# EAGLE design pt2MX (EAGLE 6.4)
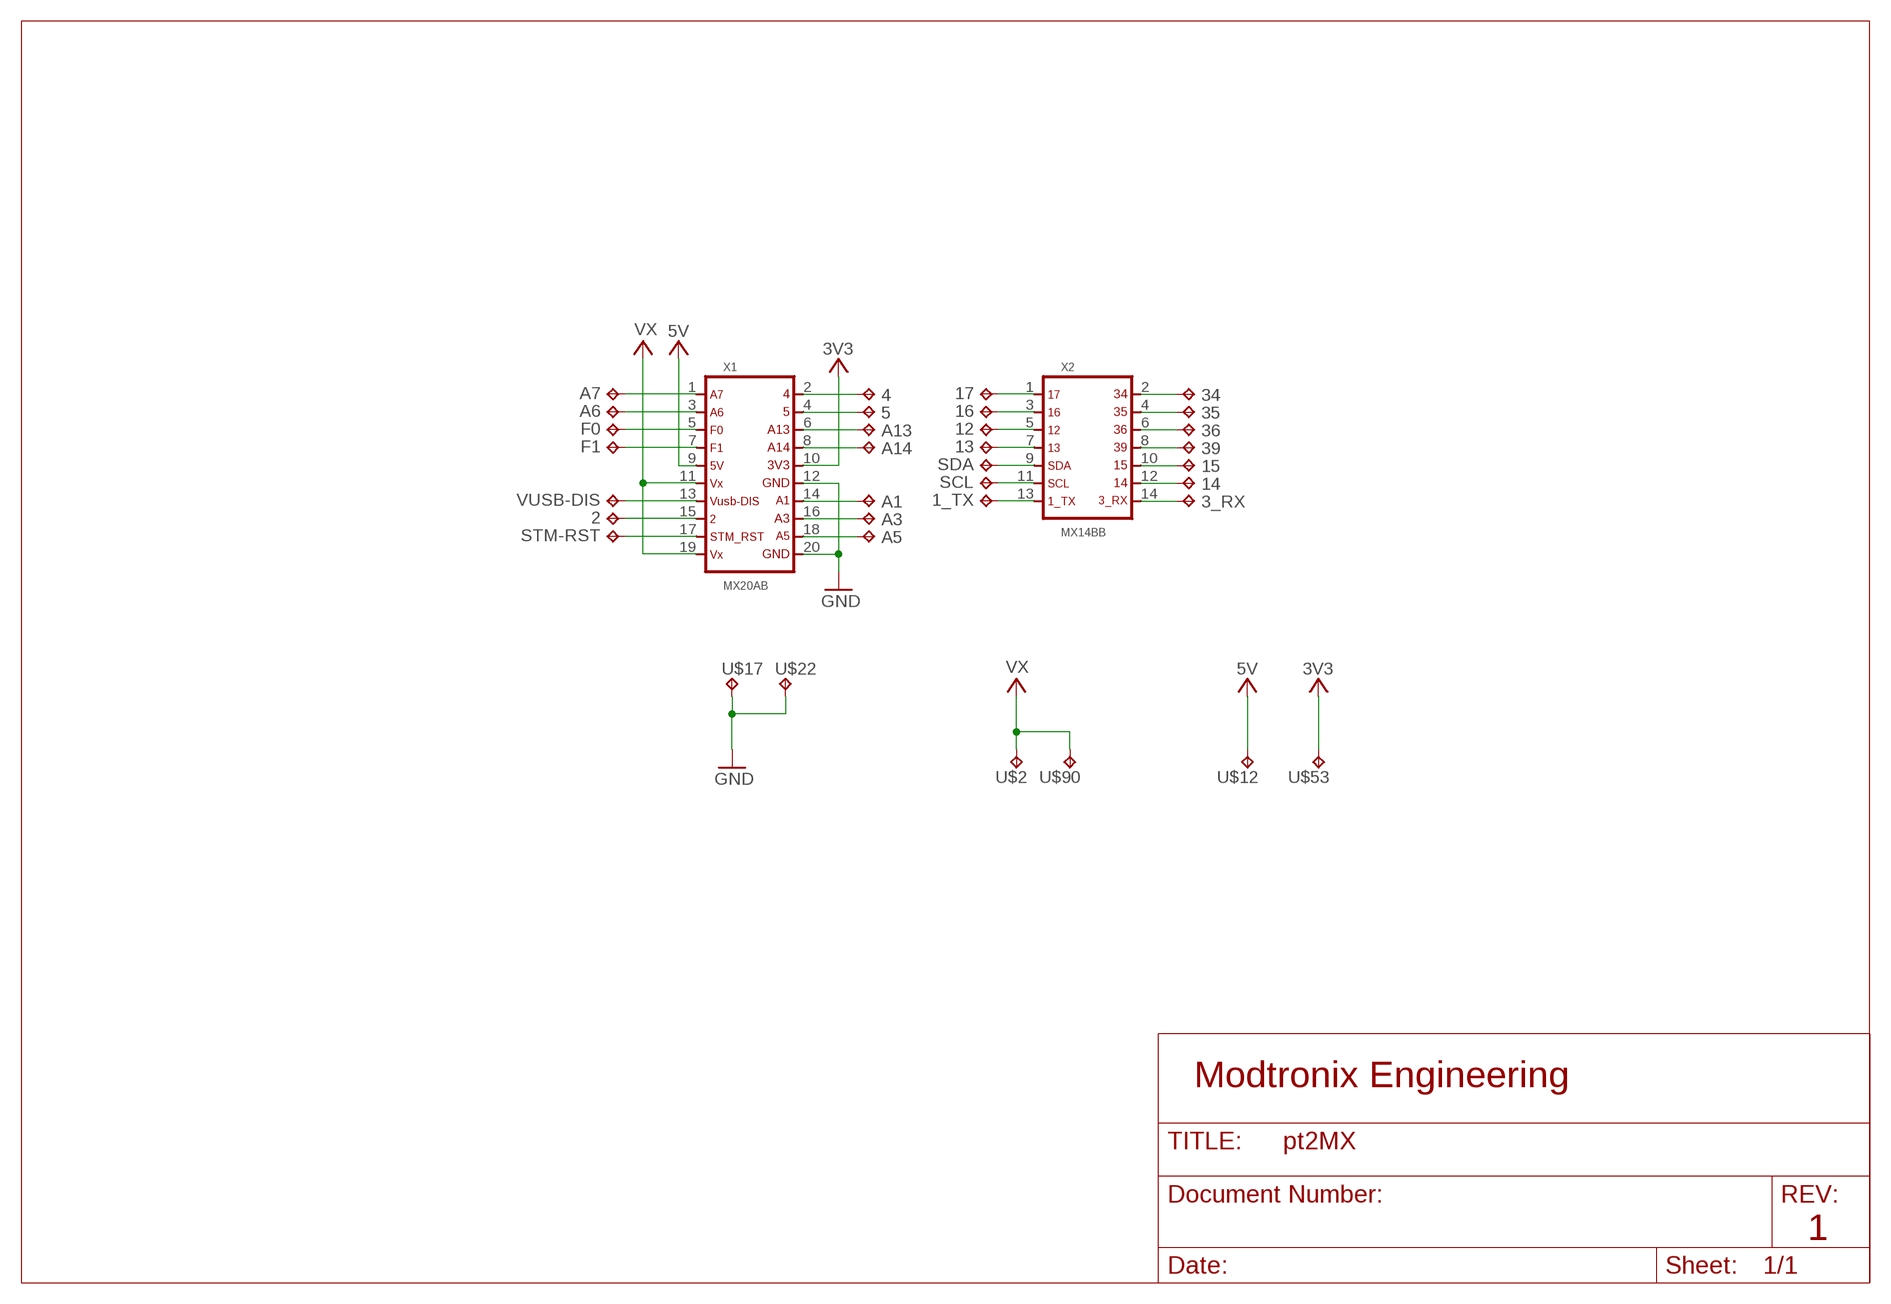
[diagram p0: schematic, sheet 1]

## Parts
1_TX  TPD10-D200  [TP-10-D200]
2  TPD10-D200  [TP-10-D200]
3_RX  TPD10-D200  [TP-10-D200]
4  TPD10-D200  [TP-10-D200]
5  TPD10-D200  [TP-10-D200]
12  TPD10-D200  [TP-10-D200]
13  TPD10-D200  [TP-10-D200]
14  TPD10-D200  [TP-10-D200]
15  TPD10-D200  [TP-10-D200]
16  TPD10-D200  [TP-10-D200]
17  TPD10-D200  [TP-10-D200]
34  TPD10-D200  [TP-10-D200]
35  TPD10-D200  [TP-10-D200]
36  TPD10-D200  [TP-10-D200]
39  TPD10-D200  [TP-10-D200]
A1  TPD10-D200  [TP-10-D200]
A3  TPD10-D200  [TP-10-D200]
A5  TPD10-D200  [TP-10-D200]
A6  TPD10-D200  [TP-10-D200]
A7  TPD10-D200  [TP-10-D200]
A13  TPD10-D200  [TP-10-D200]
A14  TPD10-D200  [TP-10-D200]
F0  TPD10-D200  [TP-10-D200]
F1  TPD10-D200  [TP-10-D200]
SCL  TPD10-D200  [TP-10-D200]
SDA  TPD10-D200  [TP-10-D200]
STM-RST  TPD10-D200  [TP-10-D200]
U$2  TPD10-D200  [TP-10-D200]
U$12  TPD10-D200  [TP-10-D200]
U$17  TPD10-D200  [TP-10-D200]
U$22  TPD10-D200  [TP-10-D200]
U$53  TPD10-D200  [TP-10-D200]
U$90  TPD10-D200  [TP-10-D200]
VUSB-DIS  TPD10-D200  [TP-10-D200]
X1  MX20AB  [MA10-2-NONUM]
X2  MX14BB  [MA07-2-NONUM]

## Nets
1_TX: 1_TX.1(TP) X2.13
2: 2.1(TP) X1.15
3_RX: 3_RX.1(TP) X2.14
3V3: U$53.1(TP) X1.10
4: 4.1(TP) X1.2
5: 5.1(TP) X1.4
5V [power]: U$12.1(TP) X1.9
12: 12.1(TP) X2.5
13: 13.1(TP) X2.7
14: 14.1(TP) X2.12
15: 15.1(TP) X2.10
16: 16.1(TP) X2.3
17: 17.1(TP) X2.1
34: 34.1(TP) X2.2
35: 35.1(TP) X2.4
36: 36.1(TP) X2.6
39: 39.1(TP) X2.8
A1: A1.1(TP) X1.14
A3: A3.1(TP) X1.16
A5: A5.1(TP) X1.18
A6: A6.1(TP) X1.3
A7: A7.1(TP) X1.1
A13: A13.1(TP) X1.6
A14: A14.1(TP) X1.8
F0: F0.1(TP) X1.5
F1: F1.1(TP) X1.7
GND [power]: U$17.1(TP) U$22.1(TP) X1.12 X1.20
SCL: SCL.1(TP) X2.11
SDA: SDA.1(TP) X2.9
STM-RST: STM-RST.1(TP) X1.17
VUSB-DIS: VUSB-DIS.1(TP) X1.13
VX [power]: U$2.1(TP) U$90.1(TP) X1.11 X1.19

## Notes on the sheet
- Modtronix Engineering
- 1

## Library data of the parts
1_TX 2 3_RX 4 5 12-17 34-36 39 A1 A3 A5-A7 A13 A14 F0 F1 SCL SDA STM-RST U$2 U$12 U$17 U$22 U$53 U$90 VUSB-DIS = mx-conn:TP
X1 = mx-conn:MX20A
X2 = mx-conn:MX14B

## Net classes
0 default: width 0.2 mm, drill 0.5 mm, clearance 0.2 mm
1 power: width 0.3 mm, drill 0.5 mm, clearance 0.2 mm

## Board
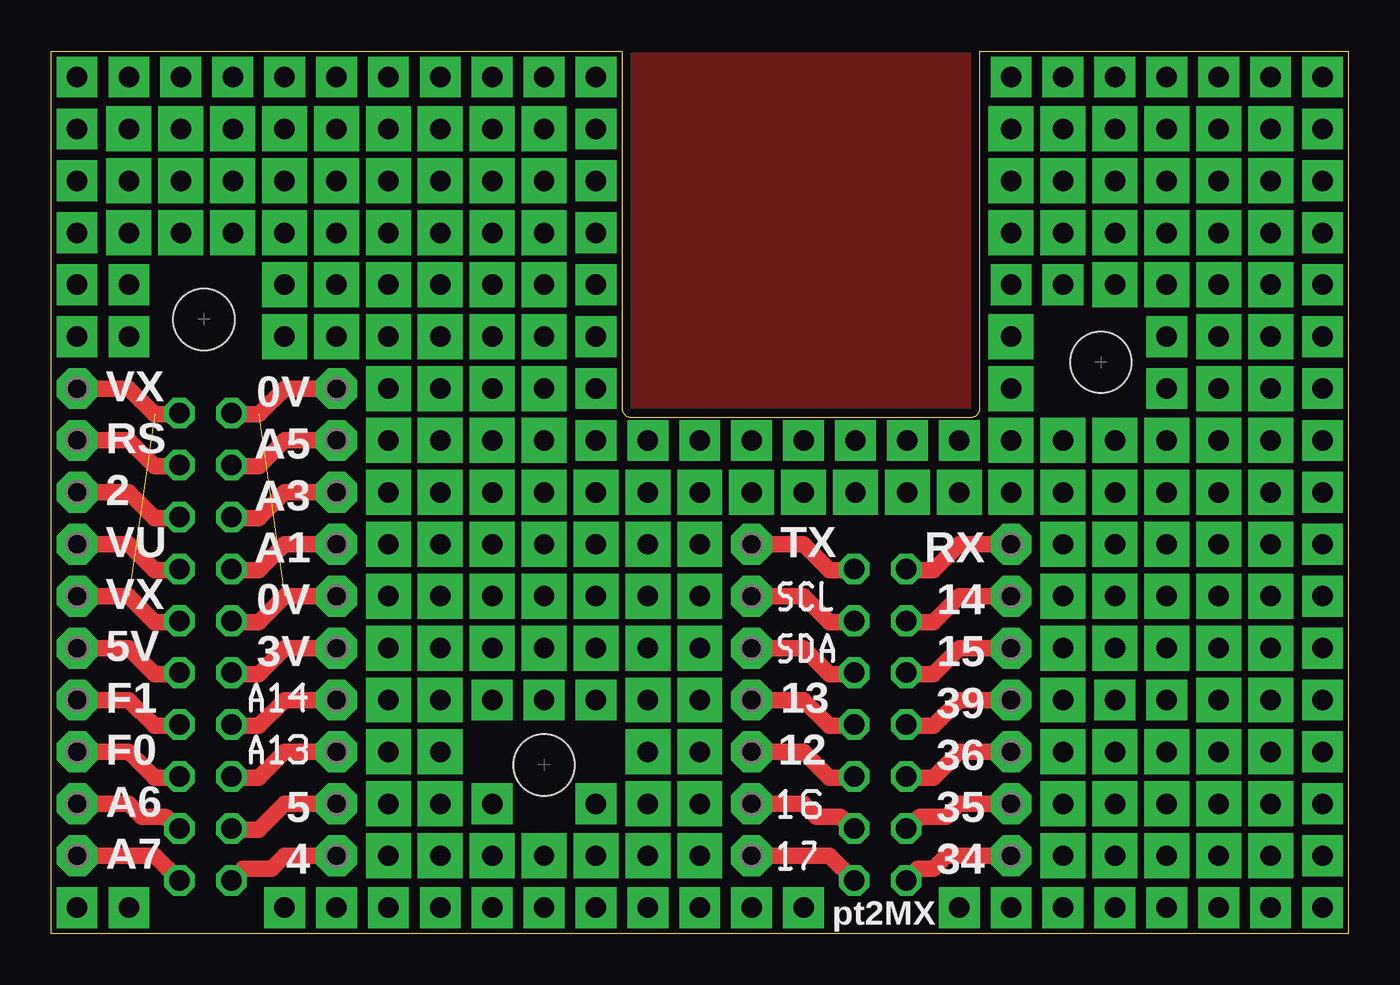
[diagram p1: board, top side]
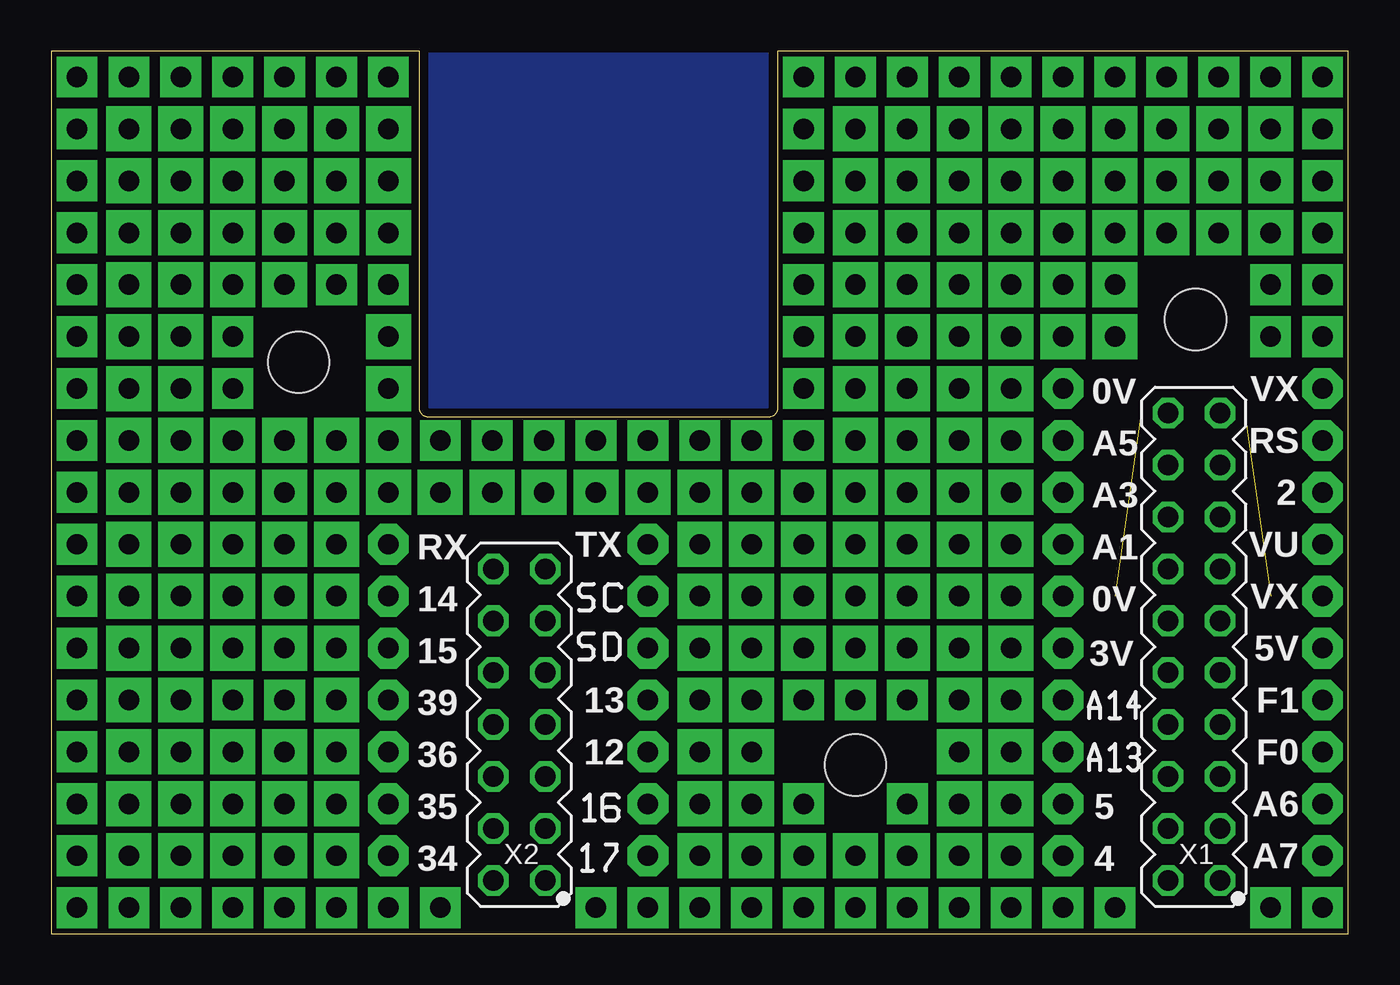
[diagram p2: board, bottom side, seen from below]

Size 63.5 x 43.18 mm. Coordinates in mm from the lower left corner, seen from the top.
Outline: 0,0 0,43.18 27.94,43.18 27.94,25.65 arc74 28.32,25.27 45.08,25.27 arc74 45.47,25.65 45.47,43.18 63.5,43.18 63.5,0 0,0
Copper layers (1*16): Top 0.035mm / dielectric 1.5mm / Bottom 0.035mm
Design rules "12w_10clr_24drl *": minimum track width 0.2mm, minimum drill 0.5mm, track to track 10mil, track to pad 10mil, pad to pad 10mil, via to via 12mil, smd to smd 6mil, copper to edge 0.1mm, drill to drill 0.1mm, minimum pad ring 0.2mm, minimum via ring 0.2mm, stop-mask expansion 4mil, vias tented up to drill 28mil, thermal gap 10mil
Holes 3 mm at 24.13,8.26 7.48,30.05 51.38,27.95
tRestrict: area 22.6,6.8 to 25.6,9.8; area 6,28.6 to 9,31.6; area 49.9,26.5 to 52.9,29.5; area 5,27.6 to 10,32.6; area 48.9,25.5 to 53.9,30.5
bRestrict: area 22.6,6.8 to 25.6,9.8; area 6,28.6 to 9,31.6; area 49.9,26.5 to 52.9,29.5; area 5,27.6 to 10,32.6; area 48.9,25.5 to 53.9,30.5

### Footprints (pad centres in the part's own frame; a part is rotated, then mirrored left to right if it is on the bottom)
TP-10-D200 = drill 1 pad 2 octagon: 1 0,0
MA10-2-NONUM = drill 1 octagon: 1 -11.43,-1.27; 2 -11.43,1.27; 3 -8.89,-1.27; 4 -8.89,1.27; 5 -6.35,-1.27; 6 -6.35,1.27; 7 -3.81,-1.27; 8 -3.81,1.27; 9 -1.27,-1.27; 10 -1.27,1.27; 11 1.27,-1.27; 12 1.27,1.27; 13 3.81,-1.27; 14 3.81,1.27; 15 6.35,-1.27; 16 6.35,1.27; 17 8.89,-1.27; 18 8.89,1.27; 19 11.43,-1.27; 20 11.43,1.27
MA07-2-NONUM = drill 1 octagon: 1 -7.62,-1.27; 2 -7.62,1.27; 3 -5.08,-1.27; 4 -5.08,1.27; 5 -2.54,-1.27; 6 -2.54,1.27; 7 0,-1.27; 8 0,1.27; 9 2.54,-1.27; 10 2.54,1.27; 11 5.08,-1.27; 12 5.08,1.27; 13 7.62,-1.27; 14 7.62,1.27

### Placement (x,y rotation side)
1_TX  34.29,19.05 270 top
2  1.27,21.59 270 top
3_RX  46.99,19.05 270 top
4  13.97,3.81 270 top
5  13.97,6.35 270 top
12  34.29,8.89 270 top
13  34.29,11.43 270 top
14  46.99,16.51 180 top
15  46.99,13.97 180 top
16  34.29,6.35 270 top
17  34.29,3.81 270 top
34  46.99,3.81 0 top
35  46.99,6.35 270 top
36  46.99,8.89 270 top
39  46.99,11.43 0 top
A1  13.97,19.05 270 top
A3  13.97,21.59 270 top
A5  13.97,24.13 270 top
A6  1.27,6.35 270 top
A7  1.27,3.81 270 top
A13  13.97,8.89 270 top
A14  13.97,11.43 270 top
F0  1.27,8.89 270 top
F1  1.27,11.43 270 top
SCL  34.29,16.51 270 top
SDA  34.29,13.97 270 top
STM-RST  1.27,24.13 270 top
U$1  [S-56N]  35.69,15.88 0 top
U$2  1.27,16.51 90 top
U$3  [ESP32MX_20-14P_0H_REF]  24.13,8.26 0 top
U$4  [S-56N]  35.69,13.34 0 top
U$5  [C-56N]  36.7,15.88 0 top
U$6  [D-56N]  36.7,13.34 0 top
U$7  [A-56N]  37.72,13.34 0 top
U$8  [L-56N]  37.72,15.88 0 top
U$9  [A-56N]  12.7,10.54 0 bottom
U$10  [A-56N]  9.78,10.92 0 top
U$11  [A-56N]  9.78,8.38 0 top
U$12  1.27,13.97 90 top
U$13  [A-56N]  12.7,8 0 bottom
U$14  [4-56N]  10.79,10.54 0 bottom
U$17  13.97,16.51 0 top
U$22  13.97,26.67 0 top
U$23  [3-56N]  10.79,8 0 bottom
U$37  [3-56]  11.68,8.38 0 top
U$39  [4-56]  11.68,10.92 0 top
U$41  [1-56N]  10.79,8.38 0 top
U$42  [1-56N]  10.79,10.92 0 top
U$48  [1-56N]  35.69,5.72 0 top
U$49  [6-56]  36.83,5.72 0 top
U$50  [1-56N]  35.69,3.18 0 top
U$51  [S-56]  37.65,13.42 0 bottom
U$52  [7-56N]  36.83,3.18 0 top
U$53  13.97,13.97 0 top
U$54  [S-56]  37.65,15.83 0 bottom
U$55  [D-56]  36.38,13.42 0 bottom
U$57  [C-56]  36.38,15.83 0 bottom
U$61  [1-56N]  37.4,5.54 0 bottom
U$62  [6-56]  36.51,5.54 0 bottom
U$63  [1-56N]  37.5,3.09 0 bottom
U$64  [7-56N]  36.36,3.09 0 bottom
U$68  [1-56N]  11.68,8 0 bottom
U$69  [1-56N]  11.68,10.54 0 bottom
U$90  1.27,26.67 0 top
VUSB-DIS  1.27,19.05 270 top
X1  7.56,14.04 90 bottom
X2  40.58,10.23 90 bottom

### Tracks (layer width: path | path; a pad name or v marks a point on that pad's centre or on a via)
1_TX
  Top 0.8: 1_TX.1 36.83,19.05 38.1,17.78 39.24,17.78 X2.13
2
  Top 0.8: 2.1 3.81,21.59 5.08,20.32 6.22,20.32 X1.15
3_RX
  Top 0.8: 3_RX.1 44.45,19.05 43.18,17.78 41.91,17.78 X2.14
3V3
  Top 0.8: U$53.1 11.43,13.97 10.16,12.7 8.89,12.7 X1.10
4
  Top 0.8: 4.1 11.43,3.81 10.79,3.18 9.4,3.18 X1.2
5
  Top 0.8: 5.1 11.43,6.35 10.16,5.08 8.89,5.08 X1.4
5V
  Top 0.8: U$12.1 3.81,13.97 5.08,12.7 6.22,12.7 X1.9
12
  Top 0.8: 12.1 36.83,8.89 38.1,7.62 39.24,7.62 X2.5
13
  Top 0.8: 13.1 36.83,11.43 38.1,10.16 39.24,10.16 X2.7
14
  Top 0.8: 14.1 44.45,16.51 43.18,15.24 41.91,15.24 X2.12
15
  Top 0.8: 15.1 44.45,13.97 43.18,12.7 41.91,12.7 X2.10
16
  Top 0.8: 16.1 36.83,6.35 37.47,5.72 38.61,5.72 X2.3
17
  Top 0.8: 17.1 38.1,3.81 X2.1
34
  Top 0.8: 34.1 43.81,3.81 43.18,3.18 42.42,3.18 X2.2
35
  Top 0.8: 35.1 44.45,6.35 43.81,5.72 42.55,5.72 X2.4
36
  Top 0.8: 36.1 44.45,8.89 43.18,7.62 41.91,7.62 X2.6
39
  Top 0.8: 39.1 44.45,11.43 43.18,10.16 41.91,10.16 X2.8
A1
  Top 0.8: A1.1 11.43,19.05 10.16,17.78 8.89,17.78 X1.14
A3
  Top 0.8: A3.1 11.43,21.59 10.16,20.32 8.89,20.32 X1.16
A5
  Top 0.8: A5.1 11.43,24.13 10.16,22.86 8.89,22.86 X1.18
A6
  Top 0.8: A6.1 3.81,6.35 4.45,5.72 5.59,5.72 X1.3
A7
  Top 0.8: A7.1 5.08,3.81 5.71,3.18 5.72,3.18 X1.1
A13
  Top 0.8: A13.1 11.43,8.89 10.16,7.62 8.89,7.62 X1.6
A14
  Top 0.8: A14.1 11.43,11.43 10.16,10.16 8.89,10.16 X1.8
F0
  Top 0.8: F0.1 3.81,8.89 5.08,7.62 6.22,7.62 X1.5
F1
  Top 0.8: F1.1 3.81,11.43 5.08,10.16 6.22,10.16 X1.7
GND  (1 unrouted)
  Top 0.8: U$17.1 11.43,16.51 10.16,15.24 8.89,15.24 X1.12 | U$22.1 11.43,26.67 10.16,25.4 8.89,25.4 X1.20
  pour Top (isolate 0.406): 26.11,42.89 47.52,42.89 47.52,23.5 26.11,23.5
  pour Bottom (isolate 0.406): 26.11,42.89 47.52,42.89 47.52,23.5 26.11,23.5
N$1  (via drill 1 pad 2)
  other vias: 11.43,1.27
N$2  (via drill 1 pad 2)
  other vias: 54.61,11.43
N$3  (via drill 1 pad 2.2)
  other vias: 57.15,11.43
N$4  (via drill 1 pad 2.2)
  other vias: 59.69,11.43
N$5  (via drill 1 pad 2)
  other vias: 62.23,11.43
N$6  (via drill 1 pad 2)
  other vias: 13.97,1.27
N$7  (via drill 1 pad 2)
  other vias: 16.51,1.27
N$8  (via drill 1 pad 2)
  other vias: 19.05,1.27
N$9  (via drill 1 pad 2)
  other vias: 21.59,1.27
N$10  (via drill 1 pad 2)
  other vias: 24.13,1.27
N$11  (via drill 1 pad 2)
  other vias: 26.67,1.27
N$12  (via drill 1 pad 2)
  other vias: 29.21,1.27
N$13  (via drill 1 pad 2)
  other vias: 31.75,1.27
N$14  (via drill 1 pad 2)
  other vias: 34.29,1.27
N$15  (via drill 1 pad 2)
  other vias: 36.83,1.27
N$16  (via drill 1 pad 2)
  other vias: 44.45,1.27
N$17  (via drill 1 pad 2)
  other vias: 46.99,1.27
N$18  (via drill 1 pad 2)
  other vias: 49.53,1.27
N$19  (via drill 1 pad 2)
  other vias: 52.07,1.27
N$20  (via drill 1 pad 2)
  other vias: 54.61,1.27
N$21  (via drill 1 pad 2)
  other vias: 57.15,1.27
N$22  (via drill 1 pad 2)
  other vias: 59.69,1.27
N$23  (via drill 1 pad 2)
  other vias: 62.23,1.27
N$24  (via drill 1 pad 2)
  other vias: 3.81,1.27
N$25  (via drill 1 pad 2)
  other vias: 1.27,1.27
N$42  (via drill 1 pad 2)
  other vias: 62.23,13.97
N$43  (via drill 1 pad 2.2)
  other vias: 59.69,13.97
N$44  (via drill 1 pad 2.2)
  other vias: 57.15,13.97
N$45  (via drill 1 pad 2.2)
  other vias: 54.61,13.97
N$46  (via drill 1 pad 2.2)
  other vias: 52.07,13.97
N$47  (via drill 1 pad 2.2)
  other vias: 49.53,13.97
N$48  (via drill 1 pad 2)
  other vias: 46.99,31.75
N$49  (via drill 1 pad 2)
  other vias: 49.53,31.75
N$51  (via drill 1 pad 2)
  other vias: 26.67,41.91
N$52  (via drill 1 pad 2.2)
  other vias: 49.53,21.59
N$53  (via drill 1 pad 2.2)
  other vias: 49.53,19.05
N$54  (via drill 1 pad 2.2)
  other vias: 49.53,16.51
N$55  (via drill 1 pad 2.2)
  other vias: 52.07,16.51
N$56  (via drill 1 pad 2.2)
  other vias: 52.07,19.05
N$57  (via drill 1 pad 2.2)
  other vias: 52.07,21.59
N$58  (via drill 1 pad 2.2)
  other vias: 54.61,21.59
N$59  (via drill 1 pad 2.2)
  other vias: 54.61,16.51
N$60  (via drill 1 pad 2.2)
  other vias: 54.61,19.05
N$61  (via drill 1 pad 2.2)
  other vias: 54.61,24.13
N$62  (via drill 1 pad 2)
  other vias: 54.61,26.67
N$63  (via drill 1 pad 2)
  other vias: 54.61,29.21
N$64  (via drill 1 pad 2.2)
  other vias: 52.07,24.13
N$67  (via drill 1 pad 2.2)
  other vias: 52.07,31.75
N$68  (via drill 1 pad 2.2)
  other vias: 52.07,34.29
N$69  (via drill 1 pad 2.2)
  other vias: 52.07,36.83
N$70  (via drill 1 pad 2.2)
  other vias: 52.07,39.37
N$71  (via drill 1 pad 2)
  other vias: 52.07,41.91
N$72  (via drill 1 pad 2)
  other vias: 54.61,41.91
N$73  (via drill 1 pad 2)
  other vias: 57.15,41.91
N$74  (via drill 1 pad 2)
  other vias: 59.69,41.91
N$75  (via drill 1 pad 2)
  other vias: 62.23,41.91
N$129  (via drill 1 pad 2)
  other vias: 62.23,8.89
N$144  (via drill 1 pad 2.2)
  other vias: 59.69,3.81
N$145  (via drill 1 pad 2.2)
  other vias: 59.69,6.35
N$146  (via drill 1 pad 2.2)
  other vias: 59.69,8.89
N$149  (via drill 1 pad 2.2)
  other vias: 57.15,8.89
N$150  (via drill 1 pad 2.2)
  other vias: 57.15,6.35
N$151  (via drill 1 pad 2.2)
  other vias: 57.15,3.81
N$164  (via drill 1 pad 2)
  other vias: 62.23,6.35
N$165  (via drill 1 pad 2)
  other vias: 62.23,3.81
N$166  (via drill 1 pad 2.2)
  other vias: 49.53,3.81
N$167  (via drill 1 pad 2.2)
  other vias: 52.07,3.81
N$168  (via drill 1 pad 2.2)
  other vias: 54.61,3.81
N$169  (via drill 1 pad 2.2)
  other vias: 54.61,6.35
N$170  (via drill 1 pad 2.2)
  other vias: 52.07,6.35
N$171  (via drill 1 pad 2.2)
  other vias: 49.53,6.35
N$172  (via drill 1 pad 2.2)
  other vias: 49.53,8.89
N$173  (via drill 1 pad 2.2)
  other vias: 54.61,8.89
N$174  (via drill 1 pad 2.2)
  other vias: 52.07,8.89
N$214  (via drill 1 pad 2)
  other vias: 62.23,39.37
N$215  (via drill 1 pad 2)
  other vias: 62.23,36.83
N$216  (via drill 1 pad 2)
  other vias: 62.23,34.29
N$217  (via drill 1 pad 2)
  other vias: 62.23,31.75
N$218  (via drill 1 pad 2)
  other vias: 62.23,29.21
N$219  (via drill 1 pad 2)
  other vias: 62.23,26.67
N$220  (via drill 1 pad 2)
  other vias: 62.23,24.13
N$221  (via drill 1 pad 2)
  other vias: 62.23,21.59
N$222  (via drill 1 pad 2)
  other vias: 62.23,19.05
N$223  (via drill 1 pad 2)
  other vias: 62.23,16.51
N$224  (via drill 1 pad 2.2)
  other vias: 59.69,16.51
N$225  (via drill 1 pad 2.2)
  other vias: 59.69,19.05
N$226  (via drill 1 pad 2.2)
  other vias: 59.69,21.59
N$227  (via drill 1 pad 2.2)
  other vias: 59.69,24.13
N$228  (via drill 1 pad 2.2)
  other vias: 59.69,26.67
N$229  (via drill 1 pad 2.2)
  other vias: 59.69,29.21
N$230  (via drill 1 pad 2.2)
  other vias: 59.69,31.75
N$231  (via drill 1 pad 2.2)
  other vias: 59.69,34.29
N$232  (via drill 1 pad 2.2)
  other vias: 59.69,36.83
N$233  (via drill 1 pad 2.2)
  other vias: 59.69,39.37
N$234  (via drill 1 pad 2.2)
  other vias: 57.15,39.37
N$235  (via drill 1 pad 2.2)
  other vias: 54.61,39.37
N$236  (via drill 1 pad 2.2)
  other vias: 54.61,36.83
N$237  (via drill 1 pad 2.2)
  other vias: 57.15,36.83
N$238  (via drill 1 pad 2.2)
  other vias: 57.15,34.29
N$239  (via drill 1 pad 2.2)
  other vias: 54.61,34.29
N$240  (via drill 1 pad 2.2)
  other vias: 54.61,31.75
N$241  (via drill 1 pad 2.2)
  other vias: 57.15,31.75
N$242  (via drill 1 pad 2.2)
  other vias: 57.15,29.21
N$243  (via drill 1 pad 2.2)
  other vias: 57.15,26.67
N$244  (via drill 1 pad 2.2)
  other vias: 57.15,24.13
N$245  (via drill 1 pad 2.2)
  other vias: 57.15,21.59
N$246  (via drill 1 pad 2.2)
  other vias: 57.15,19.05
N$247  (via drill 1 pad 2.2)
  other vias: 57.15,16.51
N$255  (via drill 1 pad 2.2)
  other vias: 46.99,26.67
N$257  (via drill 1 pad 2)
  other vias: 49.53,41.91
N$258  (via drill 1 pad 2)
  other vias: 46.99,41.91
N$261  (via drill 1 pad 2.2)
  other vias: 46.99,39.37
N$262  (via drill 1 pad 2.2)
  other vias: 49.53,39.37
N$263  (via drill 1 pad 2.2)
  other vias: 49.53,36.83
N$264  (via drill 1 pad 2.2)
  other vias: 46.99,36.83
N$267  (via drill 1 pad 2.2)
  other vias: 46.99,34.29
N$268  (via drill 1 pad 2.2)
  other vias: 49.53,34.29
N$269  (via drill 1 pad 2)
  other vias: 24.13,41.91
N$270  (via drill 1 pad 2)
  other vias: 21.59,41.91
N$271  (via drill 1 pad 2)
  other vias: 19.05,41.91
N$272  (via drill 1 pad 2)
  other vias: 16.51,41.91
N$273  (via drill 1 pad 2)
  other vias: 13.97,41.91
N$274  (via drill 1 pad 2)
  other vias: 11.43,41.91
N$275  (via drill 1 pad 2)
  other vias: 8.89,41.91
N$276  (via drill 1 pad 2)
  other vias: 6.35,41.91
N$279  (via drill 1 pad 2)
  other vias: 3.81,41.91
N$280  (via drill 1 pad 2)
  other vias: 1.27,41.91
N$283  (via drill 1 pad 2)
  other vias: 1.27,39.37
N$284  (via drill 1 pad 2.2)
  other vias: 3.81,39.37
N$285  (via drill 1 pad 2.2)
  other vias: 3.81,36.83
N$286  (via drill 1 pad 2)
  other vias: 1.27,36.83
N$289  (via drill 1 pad 2.2)
  other vias: 6.35,39.37
N$290  (via drill 1 pad 2.2)
  other vias: 11.43,39.37
N$291  (via drill 1 pad 2.2)
  other vias: 8.89,39.37
N$292  (via drill 1 pad 2.2)
  other vias: 13.97,39.37
N$293  (via drill 1 pad 2.2)
  other vias: 16.51,39.37
N$294  (via drill 1 pad 2.2)
  other vias: 19.05,39.37
N$295  (via drill 1 pad 2.2)
  other vias: 21.59,39.37
N$296  (via drill 1 pad 2.2)
  other vias: 24.13,39.37
N$297  (via drill 1 pad 2)
  other vias: 26.67,39.37
N$298  (via drill 1 pad 2.2)
  other vias: 49.53,24.13
N$299  (via drill 1 pad 2.2)
  other vias: 46.99,29.21
N$300  (via drill 1 pad 2)
  other vias: 44.45,24.13
N$301  (via drill 1 pad 2.2)
  other vias: 46.99,24.13
N$302  (via drill 1 pad 2)
  other vias: 26.67,36.83
N$303  (via drill 1 pad 2.2)
  other vias: 24.13,36.83
N$304  (via drill 1 pad 2.2)
  other vias: 21.59,36.83
N$305  (via drill 1 pad 2.2)
  other vias: 19.05,36.83
N$306  (via drill 1 pad 2.2)
  other vias: 16.51,36.83
N$307  (via drill 1 pad 2.2)
  other vias: 13.97,36.83
N$308  (via drill 1 pad 2.2)
  other vias: 11.43,36.83
N$309  (via drill 1 pad 2.2)
  other vias: 8.89,36.83
N$310  (via drill 1 pad 2.2)
  other vias: 6.35,36.83
N$313  (via drill 1 pad 2)
  other vias: 3.81,29.21
N$314  (via drill 1 pad 2.2)
  other vias: 3.81,34.29
N$319  (via drill 1 pad 2)
  other vias: 1.27,34.29
N$320  (via drill 1 pad 2)
  other vias: 1.27,31.75
N$323  (via drill 1 pad 2.2)
  other vias: 8.89,34.29
N$324  (via drill 1 pad 2.2)
  other vias: 6.35,34.29
N$325  (via drill 1 pad 2.2)
  other vias: 11.43,34.29
N$326  (via drill 1 pad 2.2)
  other vias: 13.97,34.29
N$327  (via drill 1 pad 2.2)
  other vias: 16.51,34.29
N$328  (via drill 1 pad 2.2)
  other vias: 19.05,34.29
N$329  (via drill 1 pad 2.2)
  other vias: 21.59,34.29
N$330  (via drill 1 pad 2.2)
  other vias: 24.13,34.29
N$331  (via drill 1 pad 2)
  other vias: 26.67,34.29
N$332  (via drill 1 pad 2)
  other vias: 34.29,24.13
N$333  (via drill 1 pad 2)
  other vias: 36.83,24.13
N$334  (via drill 1 pad 2.2)
  other vias: 44.45,21.59
N$335  (via drill 1 pad 2.2)
  other vias: 46.99,21.59
N$336  (via drill 1 pad 2)
  other vias: 26.67,31.75
N$337  (via drill 1 pad 2.2)
  other vias: 24.13,31.75
N$338  (via drill 1 pad 2.2)
  other vias: 21.59,31.75
N$339  (via drill 1 pad 2.2)
  other vias: 19.05,31.75
N$340  (via drill 1 pad 2.2)
  other vias: 16.51,31.75
N$341  (via drill 1 pad 2.2)
  other vias: 13.97,31.75
N$342  (via drill 1 pad 2.2)
  other vias: 11.43,31.75
N$347  (via drill 1 pad 2)
  other vias: 3.81,31.75
N$348  (via drill 1 pad 2)
  other vias: 1.27,29.21
N$367  (via drill 1 pad 2.2)
  other vias: 11.43,29.21
N$372  (via drill 1 pad 2.2)
  other vias: 13.97,29.21
N$373  (via drill 1 pad 2.2)
  other vias: 16.51,29.21
N$374  (via drill 1 pad 2.2)
  other vias: 16.51,26.67
N$375  (via drill 1 pad 2.2)
  other vias: 16.51,24.13
N$376  (via drill 1 pad 2.2)
  other vias: 19.05,24.13
N$377  (via drill 1 pad 2.2)
  other vias: 19.05,26.67
N$378  (via drill 1 pad 2.2)
  other vias: 19.05,29.21
N$379  (via drill 1 pad 2.2)
  other vias: 21.59,29.21
N$380  (via drill 1 pad 2.2)
  other vias: 21.59,26.67
N$381  (via drill 1 pad 2.2)
  other vias: 21.59,24.13
N$382  (via drill 1 pad 2.2)
  other vias: 34.29,21.59
N$383  (via drill 1 pad 2.2)
  other vias: 41.91,21.59
N$384  (via drill 1 pad 2.2)
  other vias: 39.37,21.59
N$385  (via drill 1 pad 2.2)
  other vias: 36.83,21.59
N$388  (via drill 1 pad 2.2)
  other vias: 49.53,11.43
N$389  (via drill 1 pad 2.2)
  other vias: 29.21,6.35
N$394  (via drill 1 pad 2.2)
  other vias: 16.51,3.81
N$395  (via drill 1 pad 2)
  other vias: 21.59,6.35
N$398  (via drill 1 pad 2.2)
  other vias: 31.75,3.81
N$399  (via drill 1 pad 2.2)
  other vias: 21.59,3.81
N$400  (via drill 1 pad 2.2)
  other vias: 29.21,3.81
N$401  (via drill 1 pad 2.2)
  other vias: 19.05,6.35
N$402  (via drill 1 pad 2.2)
  other vias: 16.51,6.35
N$403  (via drill 1 pad 2.2)
  other vias: 19.05,3.81
N$404  (via drill 1 pad 2.2)
  other vias: 24.13,3.81
N$405  (via drill 1 pad 2.2)
  other vias: 26.67,3.81
N$424  (via drill 1 pad 2.2)
  other vias: 16.51,8.89
N$425  (via drill 1 pad 2.2)
  other vias: 19.05,8.89
N$426  (via drill 1 pad 2.2)
  other vias: 19.05,11.43
N$427  (via drill 1 pad 2)
  other vias: 21.59,11.43
N$428  (via drill 1 pad 2)
  other vias: 26.67,11.43
N$429  (via drill 1 pad 2)
  other vias: 24.13,11.43
N$430  (via drill 1 pad 2.2)
  other vias: 29.21,11.43
N$431  (via drill 1 pad 2.2)
  other vias: 31.75,11.43
N$434  (via drill 1 pad 2.2)
  other vias: 31.75,13.97
N$435  (via drill 1 pad 2.2)
  other vias: 29.21,13.97
N$436  (via drill 1 pad 2.2)
  other vias: 26.67,13.97
N$437  (via drill 1 pad 2.2)
  other vias: 24.13,13.97
N$438  (via drill 1 pad 2.2)
  other vias: 21.59,13.97
N$439  (via drill 1 pad 2.2)
  other vias: 19.05,13.97
N$440  (via drill 1 pad 2.2)
  other vias: 16.51,11.43
N$441  (via drill 1 pad 2.2)
  other vias: 16.51,13.97
N$444  (via drill 1 pad 2.2)
  other vias: 16.51,16.51
N$445  (via drill 1 pad 2.2)
  other vias: 16.51,19.05
N$448  (via drill 1 pad 2.2)
  other vias: 16.51,21.59
N$449  (via drill 1 pad 2.2)
  other vias: 19.05,21.59
N$450  (via drill 1 pad 2.2)
  other vias: 19.05,19.05
N$451  (via drill 1 pad 2.2)
  other vias: 19.05,16.51
N$452  (via drill 1 pad 2.2)
  other vias: 21.59,16.51
N$453  (via drill 1 pad 2.2)
  other vias: 21.59,19.05
N$454  (via drill 1 pad 2.2)
  other vias: 21.59,21.59
N$455  (via drill 1 pad 2.2)
  other vias: 24.13,19.05
N$456  (via drill 1 pad 2.2)
  other vias: 24.13,16.51
N$457  (via drill 1 pad 2.2)
  other vias: 26.67,16.51
N$458  (via drill 1 pad 2.2)
  other vias: 26.67,19.05
N$459  (via drill 1 pad 2.2)
  other vias: 29.21,19.05
N$460  (via drill 1 pad 2.2)
  other vias: 29.21,16.51
N$461  (via drill 1 pad 2.2)
  other vias: 31.75,16.51
N$462  (via drill 1 pad 2.2)
  other vias: 31.75,19.05
N$465  (via drill 1 pad 2)
  other vias: 41.91,24.13
N$466  (via drill 1 pad 2)
  other vias: 39.37,24.13
N$467  (via drill 1 pad 2)
  other vias: 52.07,11.43
N$469  (via drill 1 pad 2.2)
  other vias: 31.75,8.89
N$470  (via drill 1 pad 2.2)
  other vias: 29.21,8.89
N$471  (via drill 1 pad 2)
  other vias: 26.67,6.35
N$472  (via drill 1 pad 2.2)
  other vias: 31.75,6.35
N$475  (via drill 1 pad 2.2)
  other vias: 24.13,24.13
N$476  (via drill 1 pad 2)
  other vias: 26.67,24.13
N$477  (via drill 1 pad 2)
  other vias: 29.21,24.13
N$478  (via drill 1 pad 2)
  other vias: 31.75,24.13
N$479  (via drill 1 pad 2.2)
  other vias: 31.75,21.59
N$480  (via drill 1 pad 2.2)
  other vias: 29.21,21.59
N$481  (via drill 1 pad 2.2)
  other vias: 26.67,21.59
N$482  (via drill 1 pad 2.2)
  other vias: 24.13,21.59
N$483  (via drill 1 pad 2)
  other vias: 26.67,29.21
N$484  (via drill 1 pad 2.2)
  other vias: 24.13,29.21
N$485  (via drill 1 pad 2.2)
  other vias: 24.13,26.67
N$486  (via drill 1 pad 2)
  other vias: 26.67,26.67
SCL
  Top 0.8: SCL.1 36.83,16.51 38.1,15.24 39.24,15.24 X2.11
SDA
  Top 0.8: SDA.1 36.83,13.97 38.1,12.7 39.24,12.7 X2.9
STM-RST
  Top 0.8: STM-RST.1 3.81,24.13 5.08,22.86 6.22,22.86 X1.17
VUSB-DIS
  Top 0.8: VUSB-DIS.1 3.81,19.05 5.08,17.78 6.22,17.78 X1.13
VX  (1 unrouted)
  Top 0.8: U$90.1 3.81,26.67 5.08,25.4 6.22,25.4 X1.19 | U$2.1 3.81,16.51 5.08,15.24 6.22,15.24 X1.11

### Text on the board
tPlace: 0V | VX | A5 | RS | A3 | 2 | A1 | RX | VU | TX | 0V | 14 | VX | 3V | 15 | 5V | 39 | F1 | 13 | 36 | F0 | 12 | 5 | 35 | A6 | 4 | 34 | A7 | pt2MX
bPlace: VX | 0V | RS | A5 | 2 | A3 | VU | TX | A1 | RX | VX | 0V | 14 | 5V | 3V | 15 | F1 | 13 | 39 | F0 | 12 | 36 | A6 | 5 | 35 | A7 | 4 | 34